# EAGLE design untitled (EAGLE 9.1.3)
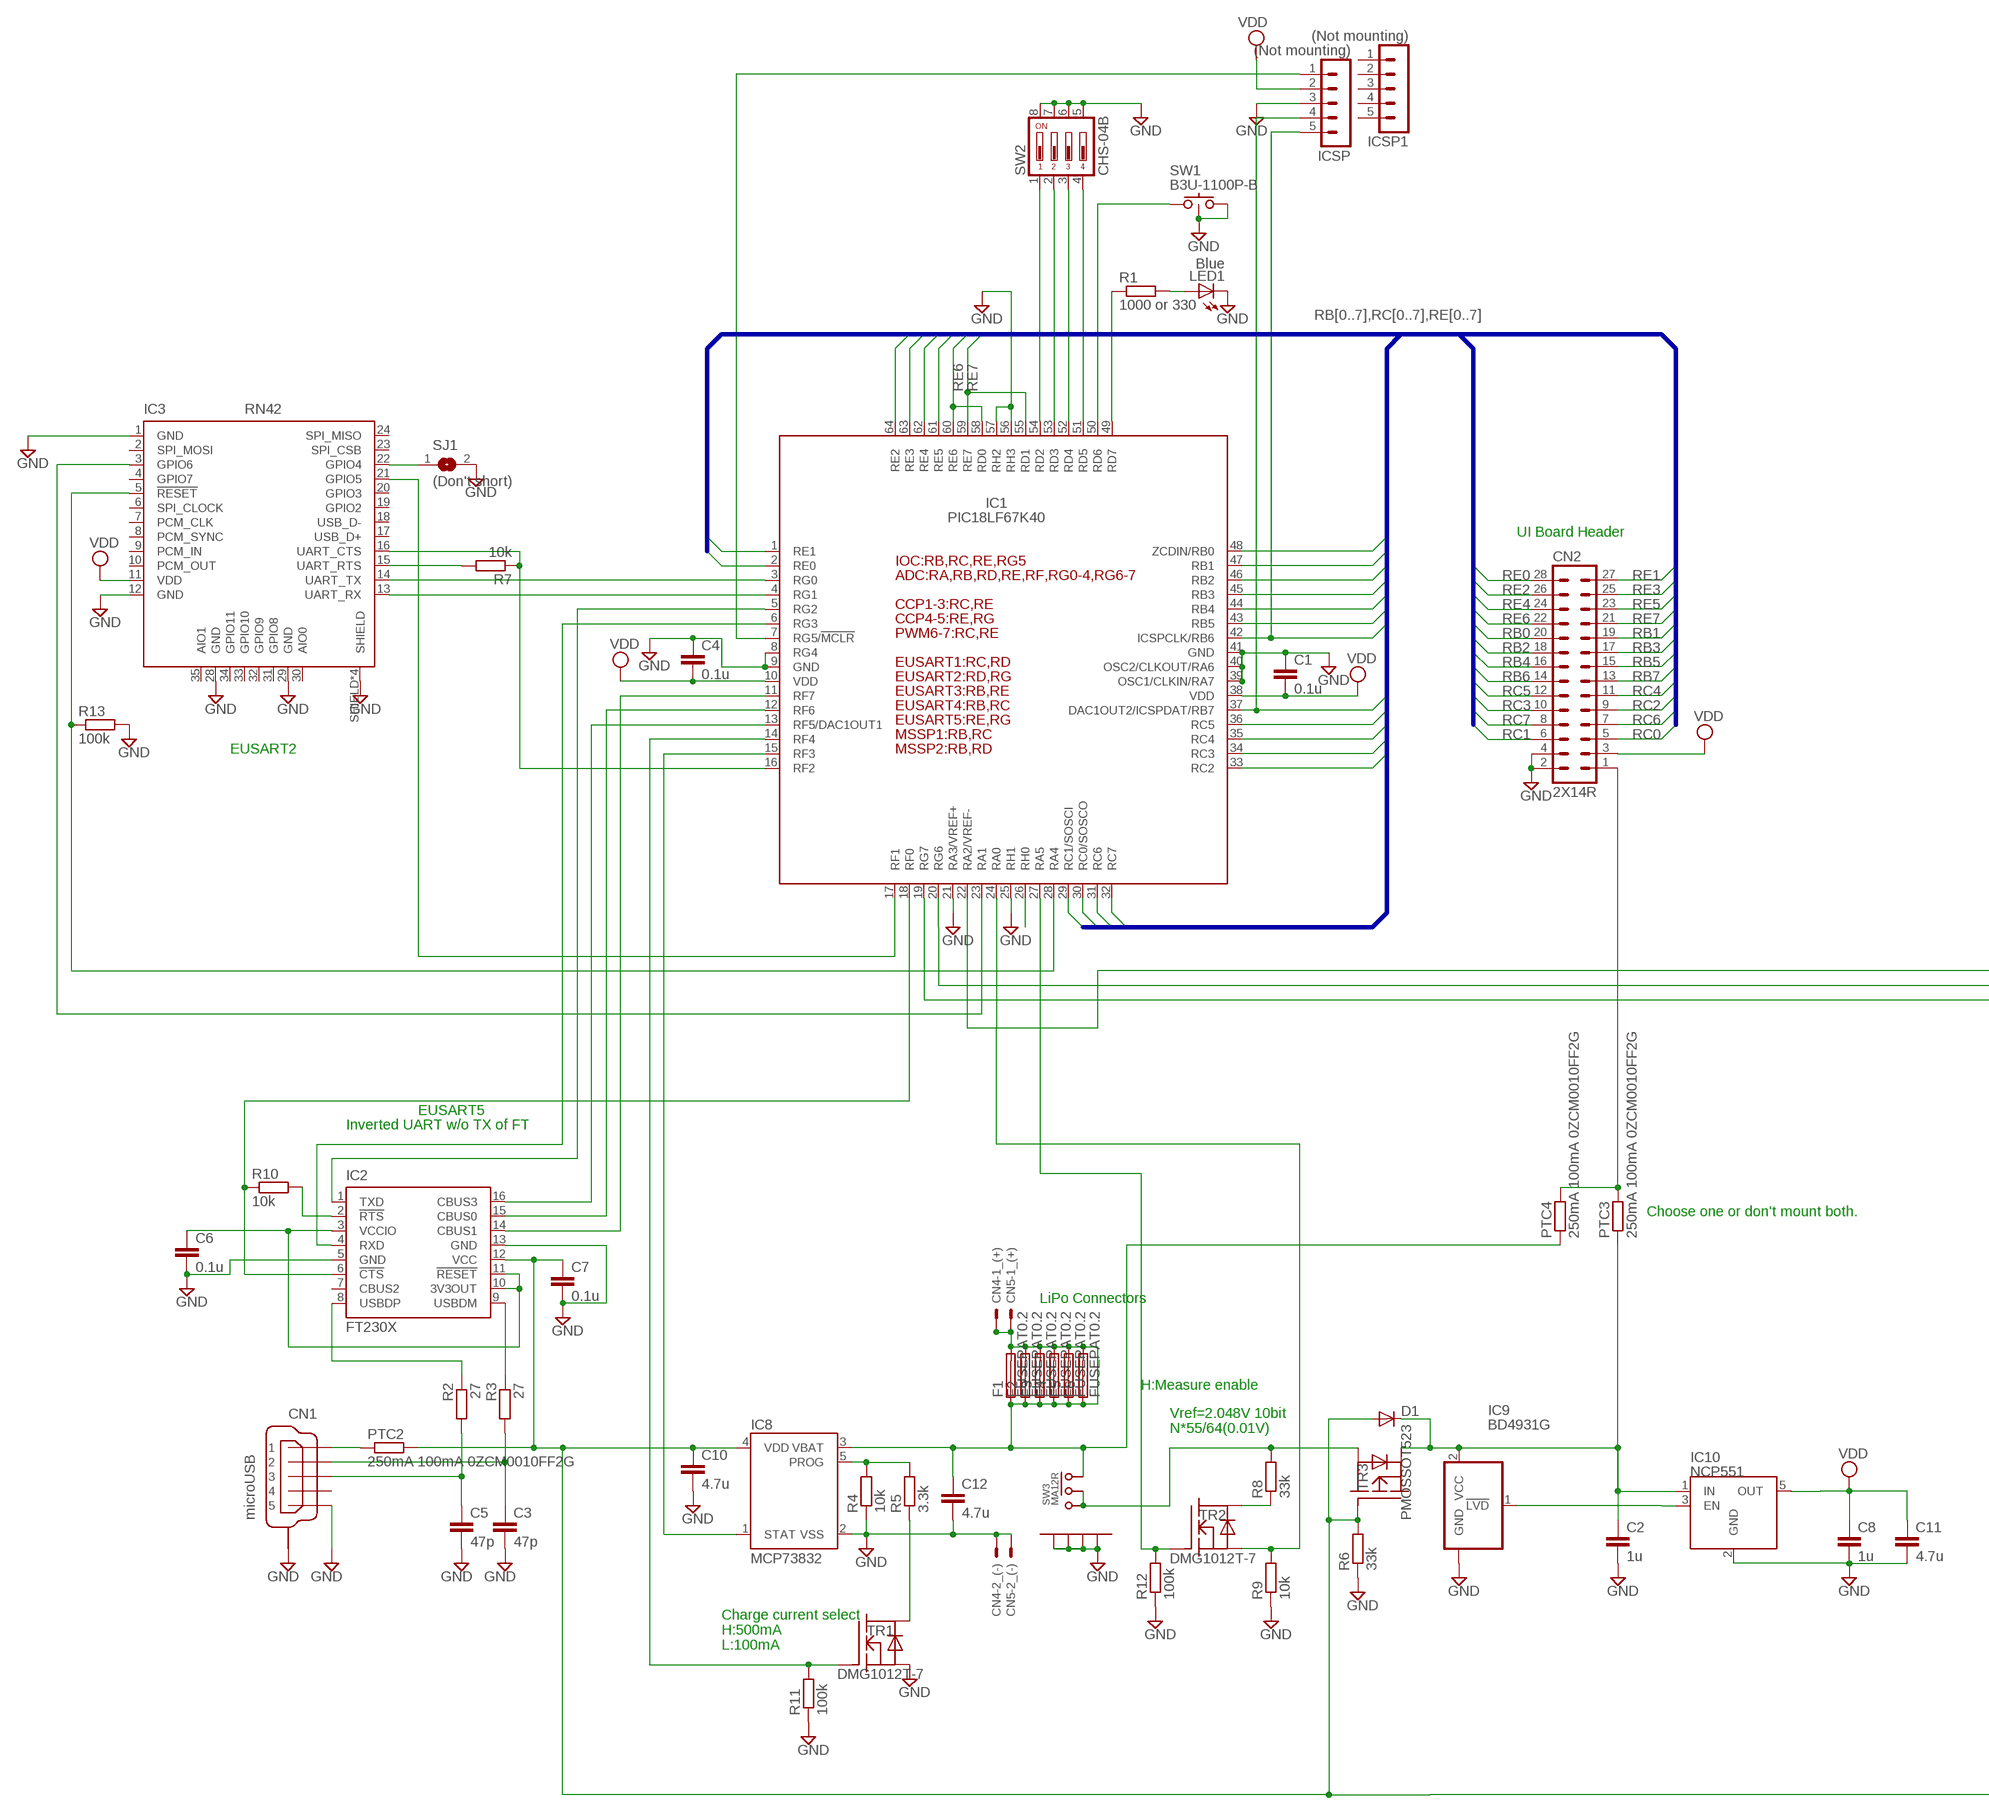
[diagram p0: schematic, sheet 1, part 1 of 2]
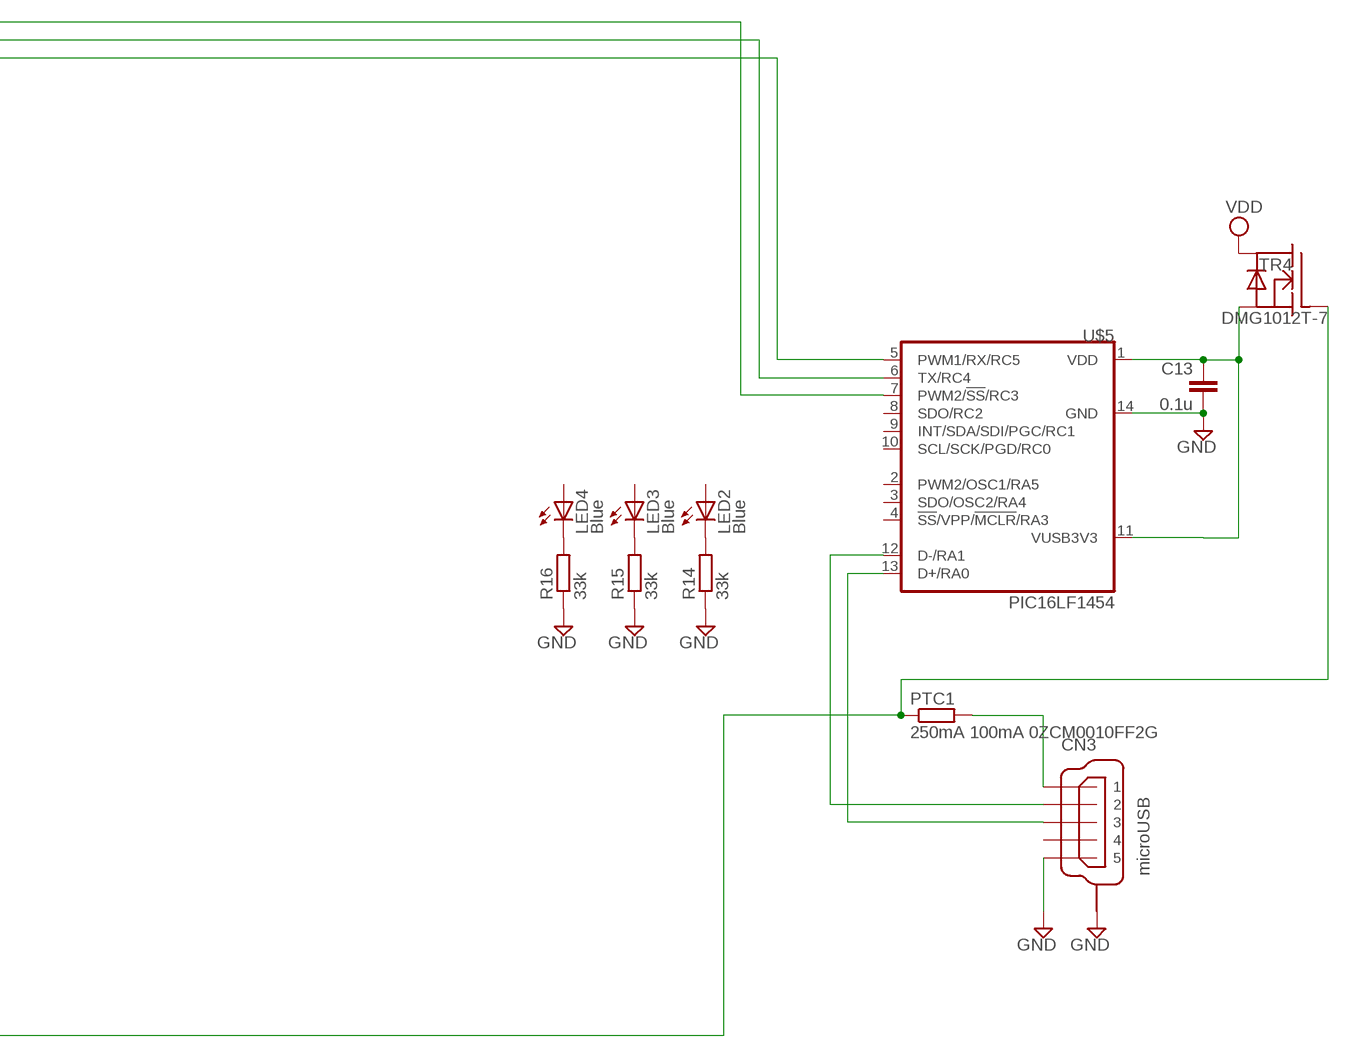
[diagram p1: schematic, sheet 1, part 2 of 2]

## Parts
C1  0.1u  C-EUC0402-SS  [C0402-SS]
C2  1u  C-EUC0805  [C0805]
C3  47p  C-EUC0402-SS  [C0402-SS]
C4  0.1u  C-EUC0402-SS  [C0402-SS]
C5  47p  C-EUC0402-SS  [C0402-SS]
C6  0.1u  C-EUC0402-SS  [C0402-SS]
C7  0.1u  C-EUC0402-SS  [C0402-SS]
C8  1u  C-EUC0805  [C0805]
C10  4.7u  C-EUC0805  [C0805]
C11  4.7u  C-EUC0805  [C0805]
C12  4.7u  C-EUC0805  [C0805]
C13  0.1u  C-EUC0402-SS  [C0402-SS]
CN1  microUSB  MICROUSB(10118194-0001LF)  [10118194-0001LF]
CN2  2X14R  [2MM_14X2_R]
CN3  microUSB  MICROUSB(10118194-0001LF)  [10118194-0001LF]
CN4  2P_(POWER)PH_S  [PH-2_S]
CN5  2P_(POWER)PH_S  [PH-2_S]
D1  DIODE-VMN2  [VMN2]
F1  FUSEPAT0.2  [FUSE_PAT1]
F2  FUSEPAT0.2  [FUSE_PAT1]
F3  FUSEPAT0.2  [FUSE_PAT1]
F4  FUSEPAT0.2  [FUSE_PAT1]
F5  FUSEPAT0.2  [FUSE_PAT1]
F6  FUSEPAT0.2  [FUSE_PAT1]
IC1  PIC18LF67K40  PIC18F67K40  [TQFP64-10X10]
IC2  FT230X  FT230XS  [SSOP16]
IC3  RN42  RN-42  [RN-42]
IC8  MCP73832  MCP73831  [SOT23-5L]
IC9  BD4931G  BD48XX  [SOT23-5L]
IC10  NCP551  [SOT23-5L]
ICSP  (Not mounting)  MA05-1  [MA05-1]
ICSP1  (Not mounting)  MA05-1  [MA05-1]
LED1  Blue  LED1005  [CHIP-LED1005]
LED2  Blue  LEDCHIPLED_1606(SIDE)  [CHIP-LED1606(SIDE)]
LED3  Blue  LEDCHIPLED_1606(SIDE)  [CHIP-LED1606(SIDE)]
LED4  Blue  LEDCHIPLED_1606(SIDE)  [CHIP-LED1606(SIDE)]
PTC1  250mA 100mA 0ZCM0010FF2G  R-EU_R0603  [R0603]
PTC2  250mA 100mA 0ZCM0010FF2G  R-EU_R0603  [R0603]
PTC3  250mA 100mA 0ZCM0010FF2G  R-EU_R0603  [R0603]
PTC4  250mA 100mA 0ZCM0010FF2G  R-EU_R0603  [R0603]
R1  1000 or 330  R-EU_R0402-SS  [R0402-SS]
R2  27  R-EU_R0402-SS  [R0402-SS]
R3  27  R-EU_R0402-SS  [R0402-SS]
R4  10k  R-EU_R0402-SS  [R0402-SS]
R5  3.3k  R-EU_R0402-SS  [R0402-SS]
R6  33k  R-EU_R0402-SS  [R0402-SS]
R7  10k  R-EU_R0402-SS  [R0402-SS]
R8  33k  R-EU_R0402-SS  [R0402-SS]
R9  10k  R-EU_R0402-SS  [R0402-SS]
R10  10k  R-EU_R0402-SS  [R0402-SS]
R11  100k  R-EU_R0402-SS  [R0402-SS]
R12  100k  R-EU_R0402-SS  [R0402-SS]
R13  100k  R-EU_R0402-SS  [R0402-SS]
R14  33k  R-EU_R0402-SS  [R0402-SS]
R15  33k  R-EU_R0402-SS  [R0402-SS]
R16  33k  R-EU_R0402-SS  [R0402-SS]
SJ1  (Don't short)  SJ  [SJ]
SW1  B3U-1100P-B  SW_WITH_EARTH(B3U-1100P)  [B3U-1100P-B]
SW2  CHS-04B  [CHS-04B]
SW3  MA12R  [MA12R]
TR1  DMG1012T-7  NMOSSOT523  [SOT523]
TR2  DMG1012T-7  NMOSSOT523  [SOT523]
TR3  PMOSSOT523  [SOT523]
TR4  DMG1012T-7  NMOSSOT523  [SOT523]
U$5  PIC16LF1454  PIC16F1454  [TSSOP14]

## Nets
GND: C1.1 C2.2 C3.2 C4.1 C5.2 C6.2 C7.2 C8.2 C10.2 C11.2 C12.2 C13.2 CN1.P$5 CN1.P$6(S) CN1.P$7(S) CN1.S1(S) CN1.S2(S) CN1.S3(S) CN1.S4(S) CN1.S5(S) CN1.S6(S) CN1.S7(S) CN1.S8(S) CN1.S9(S) CN1.S10(S) CN2.2 CN2.4 CN3.P$5 CN3.P$6(S) CN3.P$7(S) CN3.S1(S) CN3.S2(S) CN3.S3(S) CN3.S4(S) CN3.S5(S) CN3.S6(S) CN3.S7(S) CN3.S8(S) CN3.S9(S) CN3.S10(S) CN4.2 CN5.2 IC1.8(RG4) IC1.9(GND) IC1.21(RA3/VREF+) IC1.25(RH1) IC1.39(OSC1/CLKIN/RA7) IC1.40(OSC2/CLKOUT/RA6) IC1.41(GND) IC1.56(RH3) IC1.57(RH2) IC2.5(GND) IC2.13(GND) IC3.1(GND) IC3.12(GND) IC3.28(GND) IC3.29(GND) IC3.SHIELD IC3.SHIELD@1(SHIELD) IC3.SHIELD@2(SHIELD) IC3.SHIELD@3(SHIELD) IC8.2(VSS) IC9.3(GND) IC10.2(GND) ICSP.3 LED1.C R4.1 R6.1 R9.1 R11.1 R12.1 R13.2 R14.1 R15.1 R16.1 SJ1.2 SW1.P$2 SW1.P$3 SW2.5 SW2.6 SW2.7 SW2.8 SW3.P$4 SW3.P$5 SW3.P$6 SW3.P$7 TR1.2(S) U$5.14(GND)
N$1: IC1.4(RG1) IC3.13(UART_RX)
N$2: IC1.5(RG2) IC2.1(TXD)
N$3: IC1.3(RG0) IC3.14(UART_TX)
N$4: IC1.26(RH0)
N$5: C5.1 CN1.P$3 R2.2
N$6: C3.1 CN1.P$2 R3.2
N$7: IC1.6(RG3) IC2.4(RXD)
N$8 [Vbat]: CN2.1 PTC3.2 PTC4.2
N$10: IC1.15(RF3) IC8.1(STAT)
N$11: CN3.P$3 U$5.13(D+/RA0)
N$12 [Vbat]: C12.1 CN4.1 CN5.1 F1.P$1 F1.P$2 F2.P$1 F2.P$2 F3.P$1 F3.P$2 F4.P$1 F4.P$2 F5.P$1 F5.P$2 F6.P$1 F6.P$2 IC8.3(VBAT) PTC4.1 SW3.P$1
N$13 [Vbat]: R8.2 SW3.P$2 SW3.P$3 TR3.3(D)
N$14: IC1.7(RG5/!MCLR) ICSP.1
N$15 [Vbat]: CN3.P$1 PTC1.2
N$16: CN3.P$2 U$5.12(D-/RA1)
N$17: C13.1 TR4.2(S) U$5.1(VDD) U$5.11(VUSB3V3)
N$18: LED2.C R14.2
N$19 [Vbat]: C7.1 C10.1 D1.A IC2.12(VCC) IC8.4(VDD) PTC1.1 PTC2.2 R6.2 TR3.1(G) TR4.1(G)
N$20 [Vbat]: CN1.P$1 PTC2.1
N$21: LED3.C R15.2
N$22: LED4.C R16.2
N$34: IC1.54(RD2) SW2.1
N$35: IC1.52(RD4) SW2.3
N$38: IC1.51(RD5) SW2.4
N$39: IC1.49(RD7) R1.1
N$40: IC1.28(RA4) IC3.5(!RESET) R13.1
N$41: LED1.A R1.2
N$42: C6.1 IC2.3(VCCIO) IC2.10(3V3OUT) IC2.11(!RESET)
N$43: IC1.50(RD6) SW1.P$1
N$44: IC2.9(USBDM) R3.1
N$45: IC1.53(RD3) SW2.2
N$46: IC2.8(USBDP) R2.1
N$48: IC1.12(RF6) IC2.15(CBUS0)
N$49: IC1.13(RF5/DAC1OUT1) IC2.16(CBUS3)
N$50: IC8.5(PROG) R4.2 R5.2
N$51: IC1.27(RA5) R12.2 TR2.1(G)
N$52: IC1.16(RF2) IC3.16(UART_CTS) R7.1
N$53: IC1.14(RF4) R11.2 TR1.1(G)
N$54: IC3.15(UART_RTS) R7.2
N$55: IC1.11(RF7) IC2.14(CBUS1)
N$56: IC2.2(!RTS) R10.2
N$57: IC1.18(RF0) IC2.6(!CTS) R10.1
N$58: IC1.17(RF1) IC3.21(GPIO5)
N$59: IC3.22(GPIO4) SJ1.1
N$70: IC9.1(!LVD!) IC10.3(EN)
N$71: R5.1 TR1.3(D)
N$72: IC1.20(RG6) U$5.6(TX/RC4)
N$73: R8.1 TR2.3(D)
N$74: IC1.24(RA0) R9.2 TR2.2(S)
N$75: IC1.22(RA2/VREF-) U$5.7(PWM2/!SS!/RC3)
N$95: IC1.19(RG7) U$5.5(PWM1/RX/RC5)
N$96: IC1.23(RA1) IC3.3(GPIO6)
RB0: CN2.20 IC1.48(ZCDIN/RB0)
RB1: CN2.19 IC1.47(RB1)
RB2: CN2.18 IC1.46(RB2)
RB3: CN2.17 IC1.45(RB3)
RB4: CN2.16 IC1.44(RB4)
RB5: CN2.15 IC1.43(RB5)
RB6: CN2.14 IC1.42(ICSPCLK/RB6) ICSP.5
RB7: CN2.13 IC1.37(DAC1OUT2/ICSPDAT/RB7) ICSP.4
RC0: CN2.5 IC1.30(RC0/SOSCO)
RC1: CN2.6 IC1.29(RC1/SOSCI)
RC2: CN2.9 IC1.33(RC2)
RC3: CN2.10 IC1.34(RC3)
RC4: CN2.11 IC1.35(RC4)
RC5: CN2.12 IC1.36(RC5)
RC6: CN2.7 IC1.31(RC6)
RC7: CN2.8 IC1.32(RC7)
RE0: CN2.28 IC1.2(RE0)
RE1: CN2.27 IC1.1(RE1)
RE2: CN2.26 IC1.64(RE2)
RE3: CN2.25 IC1.63(RE3)
RE4: CN2.24 IC1.62(RE4)
RE5: CN2.23 IC1.61(RE5)
RE6: CN2.22 IC1.58(RD0) IC1.60(RE6)
RE7: CN2.21 IC1.55(RD1) IC1.59(RE7)
VBAT [Vbat]: C2.1 D1.C IC9.2(VCC) IC10.1(IN) PTC3.1 TR3.2(S)
VDD: C1.2 C4.2 C8.1 C11.1 CN2.3 IC1.10(VDD) IC1.38(VDD) IC3.11(VDD) IC10.5(OUT) ICSP.2 TR4.3(D)
Unconnected: CN1.P$4 CN3.P$4 IC2.7(CBUS2) IC3.2(SPI_MOSI) IC3.4(GPIO7) IC3.6(SPI_CLOCK) IC3.7(PCM_CLK) IC3.8(PCM_SYNC) IC3.9(PCM_IN) IC3.10(PCM_OUT) IC3.17(USB_D+) IC3.18(USB_D-) IC3.19(GPIO2) IC3.20(GPIO3) IC3.23(SPI_CSB) IC3.24(SPI_MISO) IC3.30(AIO0) IC3.31(GPIO8) IC3.32(GPIO9) IC3.33(GPIO10) IC3.34(GPIO11) IC3.35(AIO1) ICSP1.1 ICSP1.2 ICSP1.3 ICSP1.4 ICSP1.5 LED2.A LED3.A LED4.A U$5.2(PWM2/OSC1/RA5) U$5.3(SDO/OSC2/RA4) U$5.4(!SS!/VPP/!MCLR!/RA3) U$5.8(SDO/RC2) U$5.9(INT/SDA/SDI/PGC/RC1) U$5.10(SCL/SCK/PGD/RC0)

## Buses
RB[0..7],RC[0..7],RE[0..7]

## Notes on the sheet
- UI Board Header
- EUSART2
- EUSART5
- Inverted UART w/o TX of FT
- Choose one or don't mount both.
- LiPo Connectors
- H:Measure enable
- Vref=2.048V 10bit
  N*55/64(0.01V)
- Charge current select
  H:500mA
  L:100mA

## Library data of the parts
C1-C8 C10-C13 = 2 RCL:C-EU: CAPACITOR, European symbol
CN1 CN3 = 0 my parts:MICROUSB
CN2 = 4 _ll_ll_:2X14
CN4 CN5 = 4 CONNECTOR:2P_(POWER)
D1 = 5 D:DIODE-: DIODE
F1-F6 = 3 FUSE:FUSE: Fuse
IC1 = 0 my parts:PIC18F6*
IC2 = ftdichip:FT230X: USB to BASIC UART IC Auto generated by make-symbol-device-package-bsdl.ulp Rev. 43 Source: Data sheet <http://www.ftdichip.com/Support/Documents/DataSheets/ICs/DS_FT230X.pdf>
IC3 = 0 my parts:RN-42
IC8 = 0 my parts:MCP73831
IC9 = 0 my parts:BD48XX
IC10 = 0 my parts:NCP551
ICSP ICSP1 = 4 _l__l_:MA05-1: PIN HEADER
LED1-LED4 = 0 my parts:LED: LED OSRAM: - CHIPLED LG R971, LG N971, LY N971, LG Q971, LY Q971, LO R971, LY R971 LH N974, LH R974 LS Q976, LO Q976, LY Q976 LO Q996 - Hyper CHIPLED LW Q18S LB Q993, LB Q99A, LB R99A - SideLED LS A670, LO A670, LY A670, LG A670, LP A670 LB A673, LV A673, LT A673, LW A673 LH A674 LY A675 LS A676, LA A676, LO A676, LY A676, LW A676 LS A679, LY A679, LG A679 - Hyper Micro SIDELED® LS Y876, LA Y876, LO Y876, LY Y876 LT Y87S - SmartLED LW L88C, LW L88S LB L89C, LB L89S, LG L890 LS L89K, LO L89K, LY L89K LS L896, LA L896, LO L896, LY L896 - TOPLED LS T670, LO T670, LY T670, LG T670, LP T670 LSG T670, LSP T670, LSY T670, LOP T670, LYG T670 LG T671, LOG T671, LSG T671 LB T673, LV T673, LT T673, LW T673 LH T674 LS T676, LA T676, LO T676, LY T676, LB T676, LH T676, LSB T676, LW T676 LB T67C, LV T67C, LT T67C, LS T67K, LO T67K, LY T67K, LW E67C LS E67B, LA E67B, LO E67B, LY E67B, LB E67C, LV E67C, LT E67C LW T67C LS T679, LY T679, LG T679 LS T770, LO T770, LY T770, LG T770, LP T770 LB T773, LV T773, LT T773, LW T773 LH T774 LS E675, LA E675, LY E675, LS T675 LS T776, LA T776, LO T776, LY T776, LB T776 LHGB T686 LT T68C, LB T68C - Hyper Mini TOPLED® LB M676 - Mini TOPLED Santana® LG M470 LS M47K, LO M47K, LY M47K Source: http://www.osram.convergy.de - LUMILED® LXK2-PW12-R00, LXK2-PW12-S00, LXK2-PW14-U00, LXK2-PW14-V00 LXK2-PM12-R00, LXK2-PM12-S00, LXK2-PM14-U00 LXK2-PE12-Q00, LXK2-PE12-R00, LXK2-PE12-S00, LXK2-PE14-T00, LXK2-PE14-U00 LXK2-PB12-K00, LXK2-PB12-L00, LXK2-PB12-M00, LXK2-PB14-N00, LXK2-PB14-P00, LXK2-PB14-Q00 LXK2-PR12-L00, LXK2-PR12-M00, LXK2-PR14-Q00, LXK2-PR14-R00 LXK2-PD12-Q00, LXK2-PD12-R00, LXK2-PD12-S00 LXK2-PH12-R00, LXK2-PH12-S00 LXK2-PL12-P00, LXK2-PL12-Q00, LXK2-PL12-R00 Source: www.luxeon.com
PTC1-PTC4 R1-R16 = 2 RCL:R-EU_: RESISTOR, European symbol
SJ1 = 3 JUMPER:SJ: SMD solder JUMPER
SW1 = 0 my parts:SW_WITH_EARTH
SW2 = 3 switch-copal:CHS-04: Copal Electronics, Distributor Bürklin
SW3 = 0 my parts:MA12R
TR1 TR2 TR4 = 0 my parts:NMOS
TR3 = 0 my parts:PMOS
U$5 = 0 my parts:PIC16F1454

## Net classes
1 Vbat: clearance 0.3 mm

## Board
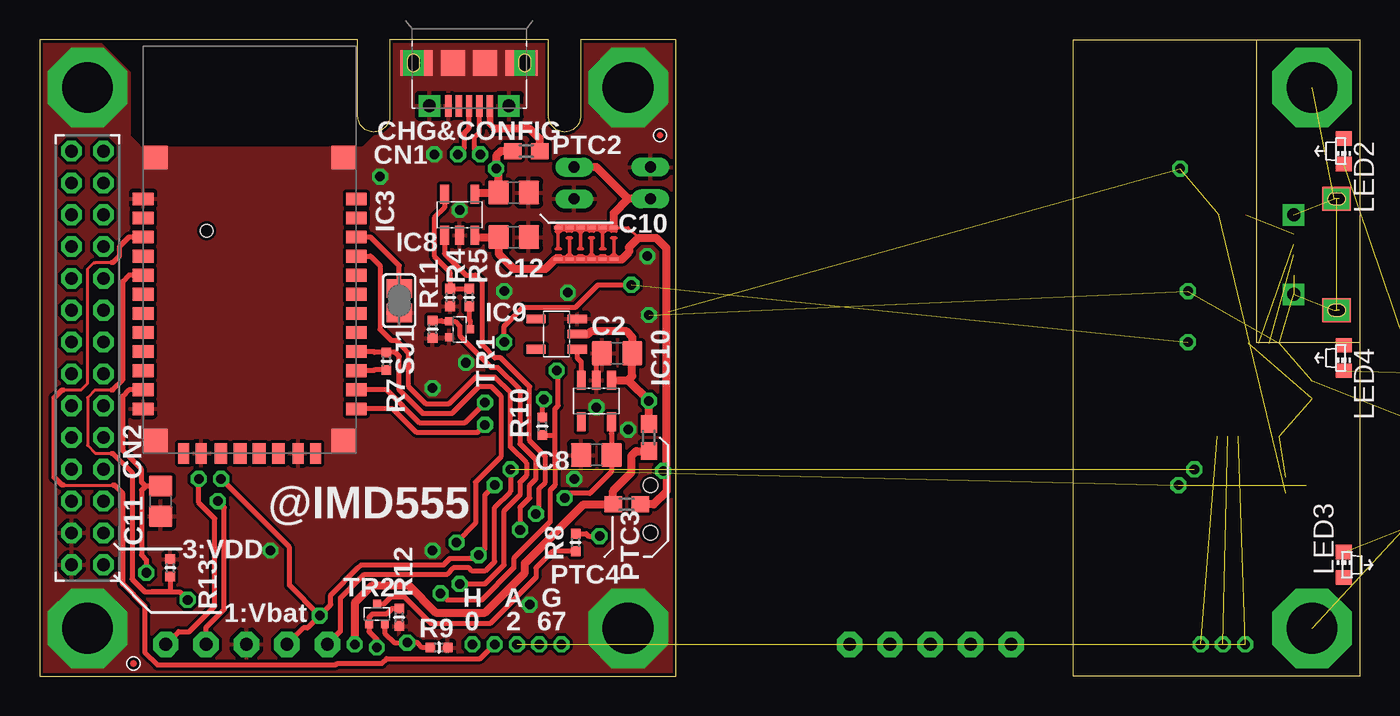
[diagram p2: board, top side]
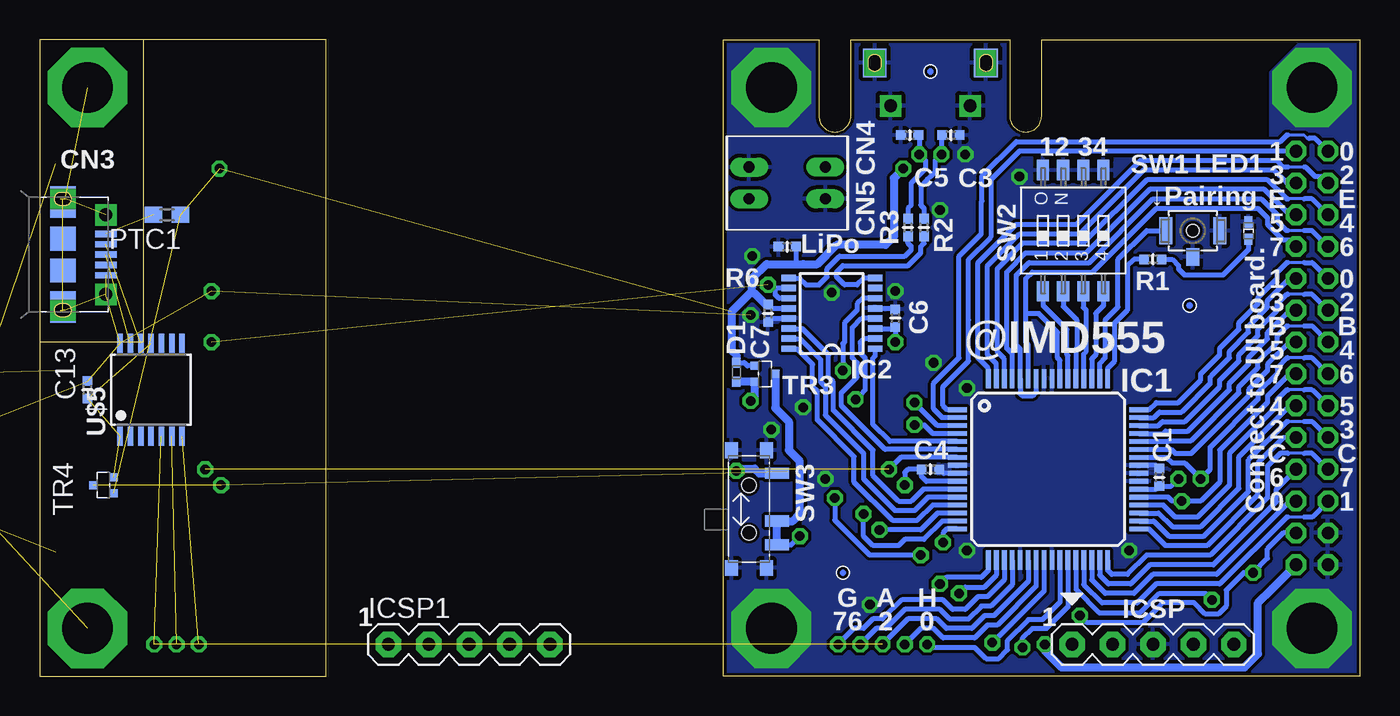
[diagram p3: board, bottom side, seen from below]

Size 83 x 40 mm. Coordinates in mm from the lower left corner, seen from the top.
Outline: 76.5,40 65,40 65,0 83,0 83,21
Outline: 76.5,40 83,40 83,21
Outline: 76.5,40 76.5,21 83,21
Outline: 0,0 40,0 40,40 34,40 34,35.2 arc-90 33,34.2 arc-90 32,35.2 32,40 22,40 22,35.2 arc-90 21,34.2 arc-90 20,35.2 20,40 0,40 0,0
Copper layers (1*16): Top 0.035mm / dielectric 1.5mm / Bottom 0.035mm
Design rules "SeeedStudio_2layer_DRU_no_angle_20140221_IMD555": minimum track width 0.2mm, minimum drill 0.3mm, track to track 0.2mm, track to pad 0.2mm, pad to pad 0.2mm, via to via 0.2mm, smd to smd 0mil, copper to edge 0.2mm, drill to drill 10mil, minimum pad ring 0.25mm, minimum via ring 0.2mm, stop-mask expansion 0.03mm, vias tented up to drill 5mm, thermal gap 10mil
tRestrict: area 3.8,33.4 to 21.8,40; 2 lines
bRestrict: area 3.8,33.4 to 21.8,40; 4 lines

### Footprints (pad centres in the part's own frame; a part is rotated, then mirrored left to right if it is on the bottom)
C0402-SS = smd 0.6 x 0.6: 1 -0.55,0; 2 0.55,0
C0805 = smd 1.3 x 1.5: 1 -0.95,0; 2 0.95,0
10118194-0001LF = smd 0.4 x 1.35: P$1 -1.3,4.15; P$2 -0.65,4.15; P$3 0,4.15; P$4 0.65,4.15; P$5 1.3,4.15 | smd 1.5 x 1.8 bottom: P$6 -3.5,1.45; P$7 3.5,1.45 | drill 0.8 pad 1.35 square: S1 -2.5,4.15; S2 2.5,4.15 | drill 0.8 pad 1.3 square: S3 -3.5,1.6; S4 -3.5,1.3; S9 3.5,1.6; S10 3.5,1.3 | smd 2 x 1.6: S5 -3.3,1.45; S8 3.3,1.45 | smd 1.5 x 1.6: S6 -1,1.45; S7 1,1.45
2MM_14X2_R = drill 0.8 pad 1.3 octagon: 1 13,1; 2 13,-1; 3 11,1; 4 11,-1; 5 9,1; 6 9,-1; 7 7,1; 8 7,-1; 9 5,1; 10 5,-1; 11 3,1; 12 3,-1; 13 1,1; 14 1,-1; 15 -1,1; 16 -1,-1; 17 -3,1; 18 -3,-1; 19 -5,1; 20 -5,-1; 21 -7,1; 22 -7,-1; 23 -9,1; 24 -9,-1; 25 -11,1; 26 -11,-1; 27 -13,1; 28 -13,-1
PH-2_S = drill 0.7 long: 1 1,0; 2 -1,0
VMN2 = smd 0.65 x 0.55: A 0.6,0; C -0.6,0
FUSE_PAT1 = smd 0.2 x 0.5: P$1 -1,0; P$2 1,0
TQFP64-10X10 = smd 1.2 x 0.3: 1 -5.7,3.75; 2 -5.7,3.25; 3 -5.7,2.75; 4 -5.7,2.25; 5 -5.7,1.75; 6 -5.7,1.25; 7 -5.7,0.75; 8 -5.7,0.25; 9 -5.7,-0.25; 10 -5.7,-0.75; 11 -5.7,-1.25; 12 -5.7,-1.75; 13 -5.7,-2.25; 14 -5.7,-2.75; 15 -5.7,-3.25; 16 -5.7,-3.75; 33 5.7,-3.75; 34 5.7,-3.25; 35 5.7,-2.75; 36 5.7,-2.25; 37 5.7,-1.75; 38 5.7,-1.25; 39 5.7,-0.75; 40 5.7,-0.25; 41 5.7,0.25; 42 5.7,0.75; 43 5.7,1.25; 44 5.7,1.75; 45 5.7,2.25; 46 5.7,2.75; 47 5.7,3.25; 48 5.7,3.75 | smd 0.3 x 1.2: 17 -3.75,-5.7; 18 -3.25,-5.7; 19 -2.75,-5.7; 20 -2.25,-5.7; 21 -1.75,-5.7; 22 -1.25,-5.7; 23 -0.75,-5.7; 24 -0.25,-5.7; 25 0.25,-5.7; 26 0.75,-5.7; 27 1.25,-5.7; 28 1.75,-5.7; 29 2.25,-5.7; 30 2.75,-5.7; 31 3.25,-5.7; 32 3.75,-5.7; 49 3.75,5.7; 50 3.25,5.7; 51 2.75,5.7; 52 2.25,5.7; 53 1.75,5.7; 54 1.25,5.7; 55 0.75,5.7; 56 0.25,5.7; 57 -0.25,5.7; 58 -0.75,5.7; 59 -1.25,5.7; 60 -1.75,5.7; 61 -2.25,5.7; 62 -2.75,5.7; 63 -3.25,5.7; 64 -3.75,5.7
SSOP16 = smd 0.914 x 0.406: 1 -2.718,2.223; 2 -2.718,1.587; 3 -2.718,0.953; 4 -2.718,0.318; 5 -2.718,-0.318; 6 -2.718,-0.953; 7 -2.718,-1.587; 8 -2.718,-2.223; 9 2.718,-2.223; 10 2.718,-1.587; 11 2.718,-0.953; 12 2.718,-0.318; 13 2.718,0.318; 14 2.718,0.953; 15 2.718,1.587; 16 2.718,2.223
RN-42 = smd 1.3 x 0.8: 1 -6.7,16; 2 -6.7,14.8; 3 -6.7,13.6; 4 -6.7,12.4; 5 -6.7,11.2; 6 -6.7,10; 7 -6.7,8.8; 8 -6.7,7.6; 9 -6.7,6.4; 10 -6.7,5.2; 11 -6.7,4; 12 -6.7,2.8; 13 6.7,2.8; 14 6.7,4; 15 6.7,5.2; 16 6.7,6.4; 17 6.7,7.6; 18 6.7,8.8; 19 6.7,10; 20 6.7,11.2; 21 6.7,12.4; 22 6.7,13.6; 23 6.7,14.8; 24 6.7,16 | smd 0.7 x 1.3: 28 3.05,0; 29 -3.05,0; 30 4.15,0; 35 -4.15,0 | smd 0.8 x 1.3: 31 1.8,0; 32 0.6,0; 33 -0.6,0; 34 -1.8,0 | smd 1.5 x 1.5: SHIELD -5.9,18.6; SHIELD@1 -5.9,0.8; SHIELD@2 5.9,0.8; SHIELD@3 5.9,18.6
SOT23-5L = smd 0.55 x 1.2: 1 -0.95,-1.3; 2 0,-1.3; 3 0.95,-1.3; 4 0.95,1.3; 5 -0.95,1.3
MA05-1 = drill 0.8 pad 1.6 octagon: 1 -5.08,0; 2 -2.54,0; 3 0,0; 4 2.54,0; 5 5.08,0
CHIP-LED1005 = smd 0.5 x 0.7: A 0,-0.55; C 0,0.55
CHIP-LED1606(SIDE) = smd 1 x 0.9: A 0,-0.8; C 0,0.8
R0603 = smd 1.1 x 1: 1 -0.85,0; 2 0.85,0
R0402-SS = smd 0.6 x 0.6: 1 -0.55,0; 2 0.55,0
SJ = smd 1.168 x 1.6: 1 -0.762,0; 2 0.762,0
B3U-1100P-B = smd 0.8 x 1.7: P$1 -1.7,0; P$2 1.7,0 | smd 0.8 x 1.1: P$3 0,-1.65 | hole 0.8: 0,0
CHS-04B = smd 0.76 x 1.27: 1 0,-3.81; 2 1.27,-3.81; 3 2.54,-3.81; 4 3.81,-3.81; 5 3.81,3.81; 6 2.54,3.81; 7 1.27,3.81; 8 0,3.81
MA12R = smd 0.7 x 1.5: P$1 -2.25,1.75; P$2 0.75,1.75; P$3 2.25,1.75 | smd 1 x 0.8: P$4 -3.7,1.1; P$5 -3.7,-1.1; P$6 3.7,-1.1; P$7 3.7,1.1 | hole 0.9: -1.5,0; 1.5,0
SOT523 = smd 0.5 x 0.5: 1 -0.5,-0.65; 2 0.5,-0.65; 3 0,0.65
TSSOP14 = smd 0.35 x 1.2: 1 -1.95,-2.925; 2 -1.3,-2.925; 3 -0.65,-2.925; 4 0,-2.925; 5 0.65,-2.925; 6 1.3,-2.925; 7 1.95,-2.925; 8 1.95,2.925; 9 1.3,2.925; 10 0.65,2.925; 11 0,2.925; 12 -0.65,2.925; 13 -1.3,2.925; 14 -1.95,2.925

### Placement (x,y rotation side)
C1  12.6,12.5 270 bottom
C2  36.3,20.3 180 top
C3  28.3,34 180 bottom
C4  27,13 180 bottom
C5  25.7,34 0 bottom
C6  29.2,22.5 90 bottom
C7  37.2,22.8 270 bottom
C8  35,13.9 180 top
C10  29.8,30.4 0 top
C11  7.6,11 270 top
C12  29.8,27.6 0 top
C13  80,18 90 bottom
CN1  27,40 180 top
CN2  3,20 270 top
CN3  83,26.5 270 bottom
CN4  33.6,31 90 bottom
CN5  38.4,31 270 bottom
D1  39.2,19.1 90 bottom
F1  35.4,27.2 90 top
F2  34.7,27.2 270 top
F3  34,27.2 90 top
F4  33.3,27.2 270 top
F5  32.6,27.2 90 top
F6  36.1,27.2 270 top
IC1  19.6,13 0 bottom
IC2  33.2,22.8 180 bottom
IC3  13.2,14 0 top
IC8  26.4,29 0 top
IC9  32.5,21.5 90 top
IC10  35,17.3 180 top
ICSP  13,2 0 bottom
ICSP1  56,2 0 bottom
LED1  7,28 0 bottom
LED2  82,33 180 top
LED3  82,7 0 top
LED4  82,20 180 top
PTC1  75,29 180 bottom
PTC2  30.6,33 180 top
PTC3  38.3,15 270 top
PTC4  36.9,10.8 180 top
R1  13,26.2 0 bottom
R2  27.4,28.2 90 bottom
R3  28.4,28.2 90 bottom
R4  25.8,23.8 90 top
R5  27,23.8 90 top
R6  36,27 0 bottom
R7  21.8,19.8 270 top
R8  33.7,8.4 90 top
R9  25.1,1.8 180 top
R10  31.6,15.7 90 top
R11  24.7,21.8 90 top
R12  22.6,3.7 90 top
R13  8.2,6.8 90 top
R14  87,16 0 top  (outside the outline)
R15  87,10 0 top  (outside the outline)
R16  88,19 0 top  (outside the outline)
SJ1  22.6,23.6 270 top
SW1  10.5,28 0 bottom
SW2  19.92,28 0 bottom
SW3  38.4,10.5 270 bottom
TR1  26.4,21.8 270 top
TR2  21.2,3.9 0 top
TR3  37.4,19 270 bottom
TR4  79,12 90 bottom
U$1  [PCB_CHECK]  5.9,0.8 0 top
U$2  [RULER]  65,43 0 top
U$3  [PCB_CHECK]  39,34 0 top
U$4  [RULER-S]  -10,0 90 bottom  (outside the outline)
U$5  76,18 0 bottom
U$6  [PCB_CHECK]  32.5,6.5 0 bottom
U$8  [PCB_CHECK]  10.7,23.3 0 bottom
U$9  [PCB_CHECK]  27,38 0 bottom

### Tracks (layer width: path | path; a pad name or v marks a point on that pad's centre or on a via)
GND  (via drill 0.6, 3.2 pad 5)  (21 unrouted)
  Top 0.3: IC10.2 35,19.95 C2.2
  Bottom 0.3: IC1.9 26.15,12.75 26.4,13 C4.1 | C1.1 12.8,13.25 IC1.41 | C7.2 36.97,22.48 IC2.13 | IC2.5 29.27,23.12 C6.2
  other vias: 21.4,31.4 24.7,18.1 14.5,7.9 24.7,7.9 29.2,24.2 30.8,4.5 38.2,26.4 24.8,32.8 37,37 3,37 3,3 37,3 37,15.5 26.8,19.7 33.2,24.1 26.4,29.3 38.3,22.7 35,16.9 33.6,12.4 80,37 80,3 72.2,24.2
  pour Bottom: 0,40 40,40 40,0 0,0
  pour Top: 0,40 40,40 40,0 0,0
N$1  (via drill 0.6)
  Top 0.3: IC3.13 22.2,16.8 23.7,15.3 27.5,15.3 v28,15.8
  Bottom 0.3: IC1.4 26.85,15.25 27.4,15.8 v28,15.8
N$2
  Bottom 0.3: IC1.5 29.55,14.75 30.6,15.8 30.6,20 30.48,20.12 IC2.1
N$3  (via drill 0.6)
  Top 0.3: IC3.14 21.8,18 23.9,15.9 26.7,15.9 v28,17.2
  Bottom 0.3: IC1.3 26.55,15.75 v28,17.2
N$4  (via drill 0.6)
  Bottom 0.3: IC1.26 18.85,4.65 19.95,3.55 20.85,3.55 22.15,2.25 22.15,1.65 22.7,1.1 23.5,1.1 24.2,1.8 27,1.8 v27.2,2
N$5  (via drill 0.6)
  Top 0.3: v26.3,32.8 26.68,33.17 26.68,34.12 27,34.45 CN1.P$3
  Bottom 0.3: C5.1 26.3,33.95 v26.3,32.8 26.7,32.4 26.7,31.7 27,31.4 27.2,31.2 27.6,30.8 27.6,29.6 27.4,29.4 R2.2
N$6  (via drill 0.6)
  Top 0.3: v27.7,32.8 27.32,33.17 27.32,33.88 27.65,34.2 CN1.P$2
  Bottom 0.3: C3.1 27.7,33.95 v27.7,32.8 27.3,32.4 27.3,31.9 28.2,31 28.2,29.6 28.4,29.4 R3.2
N$7
  Bottom 0.3: IC2.4 31.32,22.48 31.9,21.9 31.9,21.1 31.9,20 31.6,19.7 31.6,18.8 31.9,18.5 32.6,17.8 32.6,17 29.85,14.25 IC1.6
N$8  (via drill 0.6)
  Top 0.5: v19.8,2 19.8,4.6 20.9,5.7 23.2,5.7 24.9,4 28,4 30.5,6.5 30.5,7.1 34.2,10.8 PTC4.2 36.05,11.65 37.2,12.8 37.2,13.85 37.5,14.15 PTC3.2
  Bottom 0.5: v19.8,2 19.8,1.6 18.75,0.55 7.25,0.55 6.4,1.4 6.4,4.6 5.5,5.5 CN2.1
N$10  (via drill 0.6)
  Top 0.3: IC8.1 25.45,26.55 26.8,25.2 27.4,25.2 27.8,24.8 27.8,20.82 28.61,20.01 28.99,20.01 30.8,18.2 30.8,14.8 31.8,13.8 31.8,12.2 31.4,11.8 31.4,10.4 v31.2,10.2
  Bottom 0.3: IC1.15 26.25,9.75 27.4,8.6 28.6,8.6 29,8.2 30.6,8.2 31.2,8.8 v31.2,10.2
N$11  (1 unrouted)
N$12  (via drill 0.6 pad 1)
  Top 0.2: F6.P$1 37,28.2 37.65,27.55
  Top 0.5: IC8.3 27.45,27.6 C12.1 28.85,26.55 29.8,25.6 31.8,25.6 32.4,26.2 F5.P$1 F4.P$2 F3.P$1 F2.P$2 F1.P$1 F6.P$2 36.6,26.2 37.05,26.65 37.05,26.95 37.65,27.55 38.75,27.55 39.1,27.2 39.4,26.9 39.4,13.1 v39.2,12.9 39.4,12.7 39.4,11.6 38.6,10.8 PTC4.1 | CN5.1 37,30 | 37,30 35,32 CN4.1 | F5.P$2 F4.P$1 F3.P$2 F2.P$1 F1.P$2 F6.P$1 36.1,29.1 37,30
  Bottom 0.5: v39.2,12.9 39.05,13.05 38.05,13.05 37.75,12.75 SW3.P$1
N$13  (via drill 0.6 pad 1)
  Top 0.3: v35.2,8.8 34.5,8.8 34.35,8.95 R8.2
  Bottom 0.3: v35.2,8.8 35.75,8.25 SW3.P$3
  Bottom 0.5: SW3.P$3 SW3.P$2 35.65,9.75 35.2,10.2 35.2,13.5 35.9,14.2 35.9,16 36.75,16.85 TR3.3
N$14  (via drill 0.6)  (1 unrouted)
  Top 0.3: v29.6,13 29.6,11.6 28.6,10.6 28.6,7.2 28,6.6 27.2,6.6 27,6.8 26,6.8 25.6,6.4 24,6.4 23.1,6.4 20.4,6.4 20.2,6.2 18.9,4.9 18.9,2.82 ICSP.1
  Bottom 0.3: v29.6,13 28.85,13.75 IC1.7
  other vias: 72.6,13
N$15  (1 unrouted)
N$16  (1 unrouted)
N$17  (3 unrouted)
N$18  (1 unrouted)
N$19  (via drill 0.6)  (3 unrouted)
  Top 0.5: IC8.4 27.45,30.4 C10.1 28.85,31.75 v28.7,31.9 28.7,32.4 28.7,32.7 29,33 PTC2.2
  Bottom 0.3: IC2.12 36.97,23.12 C7.1 | D1.A 38.7,19.7 38.5,19.5 TR3.1 | R6.2 35.45,25.9
  Bottom 0.5: 35,25.9 37.3,25.9 38.2,25 38.2,24.5 38.2,24.2 | 35,25.9 34.1,25.9 32.9,27.1 29.8,27.1 29.3,27.6 29.3,31.3 v28.7,31.9 | 38.2,24.2 38,24 37.35,23.35 C7.1 | 38.2,24.2 39.5,22.9 39.5,20.5 39.2,20.2 D1.A | 35.45,25.9 35,25.9
  other vias: 71.7,31.9
N$20
  Top 0.4: 28.6,34.4 28.3,34.7 CN1.P$1
  Top 0.5: 28.6,34.4 30.8,34.4 31.45,33.75 PTC2.1
N$21  (1 unrouted)
N$22  (1 unrouted)
N$34
  Bottom 0.3: SW2.1 19.92,23.32 18.4,21.8 18.4,20.2 18.35,20.15 IC1.54
N$35
  Bottom 0.3: IC1.52 17.35,20.25 17.2,20.4 17.2,23 17.38,23.18 SW2.3
N$38
  Bottom 0.3: IC1.51 16.85,19.95 16.6,20.2 16.6,22.8 16.11,23.29 SW2.4
N$39
  Bottom 0.3: IC1.49 15.85,19.35 15.4,19.8 15.4,22.2 14.6,23 14.6,25.8 14.25,26.15 14.2,26.2 R1.1
N$40  (via drill 0.6)
  Top 0.2: 4.5,18 3.5,18 3,17.5 3,14.5 3.5,14 4.5,14
  Top 0.3: IC3.5 5.6,25.2 5.2,24.8 5.2,18.6 4.6,18 4.5,18 | 7,5.3 6.6,5.3 5.8,6.1 5.8,12.8 4.6,14 4.5,14 | 7,5.3 8.8,5.3 v9.3,4.8 | R13.1 8.2,5.3 7,5.3
  Bottom 0.3: IC1.28 17.85,5.45 16.4,4 13.8,4 12.6,5.2 9.7,5.2 v9.3,4.8
N$41
  Bottom 0.3: LED1.A 7,26.8 8.6,25.2 11,25.2 11.4,25.6 11.4,25.8 11.8,26.2 R1.2
N$42  (via drill 0.6)  (1 unrouted)
  Top 0.3: v37.2,24.6 35.1,24.6 33.7,23.2 30.4,23.2 29.2,22 v29.2,21
  Bottom 0.3: v37.2,24.6 36.99,24.39 IC2.10 36.76,24.39 36.76,24 36.51,23.75 IC2.11 | v29.2,21 C6.1 29.3,21.85 IC2.3
  other vias: 72.2,21
N$43
  Bottom 0.3: IC1.50 16.35,19.65 16,20 16,22.4 15.2,23.2 15.2,26.2 13.4,28 SW1.P$1
N$44
  Bottom 0.3: IC2.9 35.22,25.02 34.8,24.6 34,24.6 33.5,25.1 33.5,25.6 32.7,26.4 28.6,26.4 28.2,26.8 28.2,27 28.4,27.2 R3.1
N$45
  Bottom 0.3: SW2.2 18.65,23.25 17.8,22.4 17.8,20.6 17.85,20.55 IC1.53
N$46
  Bottom 0.3: IC2.8 31.18,25.02 31.6,24.6 32.4,24.6 32.9,25.1 32.9,25.4 32.5,25.8 28.4,25.8 27.6,26.6 27.6,27 27.4,27.2 R2.1
N$48
  Bottom 0.3: IC1.12 27.15,11.25 28,10.4 29.2,10.4 31.2,12.4 31.2,14 33.6,16.4 33.6,18.2 33.9,18.5 33.9,19 33.9,19.9 35.21,21.21 IC2.15
N$49
  Bottom 0.3: IC1.13 26.85,10.75 27.8,9.8 29.4,9.8 31.8,12.2 31.8,13.8 34.1,16.1 34.1,17.9 34.4,18.2 34.4,19.6 35.38,20.58 IC2.16
N$50
  Top 0.3: R5.2 R4.2 25.8,25.4 24.8,26.4 24.8,28.8 25.45,29.45 IC8.5
N$51  (via drill 0.6)
  Top 0.3: v21.2,1.8 21.2,2.3 20.7,2.8 TR2.1 20.7,3.7 20.9,3.9 21.8,3.9 22.15,4.25 R12.2
  Bottom 0.3: IC1.27 18.35,4.35 19.7,3 20.6,3 21.2,2.4 v21.2,1.8
N$52  (via drill 0.6)
  Top 0.3: v26.2,8.4 27.4,9.6 27.4,12.2 29,13.8 29,17.6 28.4,18.2 27.6,18.2 25.9,16.5 24.1,16.5 22.6,18 22.6,20.1 22.35,20.35 R7.1 21.05,20.35 21,20.4 IC3.16
  Bottom 0.3: IC1.16 25.95,9.25 26.2,9 v26.2,8.4
N$53  (via drill 0.6)
  Top 0.3: v30.2,9.2 30.2,10.6 30.8,11.2 30.8,12 31.2,12.4 31.2,13.6 30.2,14.6 30.2,18 28.8,19.4 28.4,19.4 26.4,21.4 26.4,22 26.1,22.3 TR1.1 25.3,22.3 25.25,22.35 R11.2
  Bottom 0.3: IC1.14 26.55,10.25 27.6,9.2 v30.2,9.2
N$54
  Top 0.3: IC3.15 21,19.2 21.05,19.25 R7.2
N$55
  Bottom 0.3: IC1.11 27.45,11.75 28.2,11 29,11 30.6,12.6 30.6,14.2 33.1,16.7 33.1,18.5 33.4,18.8 33.4,20.2 35.05,21.85 IC2.14
N$56  (via drill 0.6)
  Top 0.3: v31.7,17.4 31.6,17.3 R10.2
  Bottom 0.3: IC2.2 31.19,21.21 31.4,21 31.4,20.9 31.4,20.3 31.1,20 31.1,18 31.4,17.7 v31.7,17.4
N$57  (via drill 0.6)
  Top 0.3: v25.2,5.2 25.6,4.8 27.8,4.8 29.8,6.8 29.8,7.4 32.1,9.7 32.1,11.7 32.4,12 32.4,13.3 | 32.4,16.8 32.4,15.15 R10.1 | 32.4,16.8 32.6,17 32.6,19.1 v32.5,19.2 | 32.4,14 32.4,13.3 | 32.4,13.3 32.4,16.8
  Bottom 0.3: IC2.6 31.25,23.75 31.6,23.4 31.6,23 32.4,22.2 32.4,21 32.5,20.9 v32.5,19.2 | v25.2,5.2 24.8,5.6 23.6,5.6 22.85,6.35 IC1.18
N$58  (via drill 0.6)
  Top 0.3: IC3.21 20.8,26.4 21.4,25.8 21.4,21.8 22.1,21.1 22.4,21.1 22.9,20.6 23.2,20.3 23.2,18.2 24.3,17.1 25.7,17.1 27.4,18.8 27.5,18.8 28.6,18.8 29.6,17.8 29.6,14.4 30.6,13.4 30.6,12.6 30.2,12.2 30.2,11.4 29.2,10.4 29.2,7 28,5.8 v26.4,5.8
  Bottom 0.3: IC1.17 23.35,6.65 23.8,6.2 26,6.2 v26.4,5.8
N$59
  Top 0.3: SJ1.1 22.6,25.8 20.8,27.6 IC3.22
N$70
  Top 0.3: IC9.1 33.8,20 34.05,19.75 IC10.3
N$71
  Top 0.3: R5.1 27,22.4 27.05,22.35 TR1.3
N$72  (via drill 0.6)  (2 unrouted)
  Bottom 0.3: IC1.20 21.85,5.75 23.2,4.4 23.8,4.4 24.6,3.6 25.8,3.6 26.4,4.2 28.6,4.2 29.8,3 30.4,3 v31.4,2
  other vias: 74.4,2
N$73
  Top 0.3: TR2.3 21.65,4.55 22.1,5 22.9,5 24.6,3.3 28.3,3.3 31.2,6.2 31.2,6.8 32.25,7.85 R8.1
N$74  (via drill 0.6)
  Top 0.3: TR2.2 21.7,2.7 22.3,2.1 v23.1,2.1 23.75,2.1 24.05,1.8 R9.2
  Bottom 0.3: IC1.24 19.85,5.7 19.85,5.35 v23.1,2.1
N$75  (via drill 0.6)  (2 unrouted)
  Bottom 0.3: IC1.22 20.85,5.95 23,3.8 23.6,3.8 24.4,3 26,3 26.6,3.6 28.4,3.6 v30,2
  other vias: 73,2
N$95  (via drill 0.6)  (2 unrouted)
  Bottom 0.3: IC1.19 22.35,6.05 23.4,5 24,5 24.8,4.2 25.6,4.2 26.2,4.8 28.8,4.8 30,3.6 30.6,3.6 31.2,3 31.8,3 v32.8,2
  other vias: 75.8,2
N$96  (via drill 0.6)
  Top 0.2: 4.5,26 3.5,26 3.4,26 3,25.6 3,25.4 3,19 3,18.4 2.6,18 1.5,18 | 1.5,12 4.6,12
  Top 0.3: IC3.3 5.6,27.6 5,27 5,26.5 5,26.4 4.6,26 4.5,26 | 1.5,12 1.4,12 0.9,12.5 0.9,17.4 0.9,17.5 1.4,18 1.5,18 | 4.6,12 4.7,12 5.2,11.5 5.2,7.4 5.2,5.8 6.6,4.4 6.6,1.5 7.4,0.7 18.6,0.7 18.7,0.8 21.5,0.8 21.8,1.1 27.7,1.1 v28.6,2
  Bottom 0.3: IC1.23 20.35,5.65 22.8,3.2 23.4,3.2 24.2,2.4 26.2,2.4 26.8,3 27.6,3 v28.6,2
RB0
  Bottom 0.2: 3.5,26 4.5,26
  Bottom 0.3: 4.5,26 4.6,26 5.2,25.4 5.2,25 6.4,23.8 6.4,23.4 7.6,22.2 7.6,21.8 8.8,20.6 8.8,20.2 10,19 10,18.6 11.4,17.2 12.8,17.2 13.25,16.75 IC1.48 | 3.5,26 3,26 CN2.20
RB1
  Bottom 0.3: CN2.19 4.4,25 5.8,23.6 5.8,23.2 7,22 7,21.6 8.2,20.4 8.2,20 9.2,19 9.4,18.8 9.4,18.4 11.2,16.6 12.6,16.6 12.95,16.25 IC1.47
RB2
  Bottom 0.2: 3.5,24 4.5,24
  Bottom 0.3: CN2.18 3,24 3.5,24 | 4.5,24 4.6,24 5.2,23.4 5.2,23 6.4,21.8 6.4,21.4 7.6,20.2 7.6,19.8 8.8,18.6 8.8,18.2 11,16 12.4,16 12.65,15.75 IC1.46
RB3
  Bottom 0.3: CN2.17 4.4,23 5.8,21.6 5.8,21.2 7,20 7,19.6 8.2,18.4 8.2,18 10.8,15.4 12.2,15.4 12.35,15.25 IC1.45
RB4
  Bottom 0.2: 3.5,22 4.5,22
  Bottom 0.3: CN2.16 3,22 3.5,22 | 4.5,22 4.6,22 5.2,21.4 5.2,21 6.4,19.8 6.4,19.4 7.6,18.2 7.6,17.8 10.6,14.8 12,14.8 12.05,14.75 IC1.44
RB5
  Bottom 0.3: CN2.15 4.4,21 5.8,19.6 5.8,19.2 7,18 7,17.6 10.6,14 11.6,14 11.85,14.25 IC1.43
RB6  (via drill 0.6)
  Top 0.3: v10,12.4 10,10.9 11,9.9 11,4.4 9.4,2.8 8.72,2.8 ICSP.5
  Bottom 0.2: 3.5,20 4.5,20
  Bottom 0.3: CN2.14 3,20 3.5,20 | 4.5,20 4.6,20 5.2,19.4 5.2,19 6.4,17.8 6.4,17.4 9.4,14.4 9.4,13 v10,12.4 11,13.4 11.8,13.4 12.15,13.75 IC1.42
RB7  (via drill 0.6)
  Top 0.3: ICSP.4 10.46,3.06 11.6,4.2 11.6,10.6 v11.2,11
  Bottom 0.3: IC1.37 12.05,11.25 11.8,11 v11.2,11 10,11 8.8,12.2 8.8,14.2 5.8,17.2 5.8,17.6 4.4,19 CN2.13
RC0
  Bottom 0.3: IC1.30 16.85,6.05 16,5.2 14.2,5.2 13,6.4 9,6.4 4.4,11 CN2.5
RC1
  Bottom 0.2: 3.5,10 4.5,10
  Bottom 0.3: IC1.29 17.35,5.75 16.2,4.6 14,4.6 12.8,5.8 8.8,5.8 4.6,10 4.5,10 | CN2.6 3,10 3.5,10
RC2
  Bottom 0.3: CN2.9 4.8,15 6.4,13.4 6.4,11.4 9.6,8.2 12.2,8.2 13.25,9.25 IC1.33
RC3
  Bottom 0.2: 3.5,16 4.5,16
  Bottom 0.3: CN2.10 3,16 3.5,16 | IC1.34 12.95,9.75 12,8.8 9.8,8.8 7,11.6 7,13.6 4.6,16 4.5,16
RC4
  Bottom 0.3: IC1.35 12.65,10.25 11.8,9.4 10,9.4 7.6,11.8 7.6,13.8 4.4,17 CN2.11
RC5
  Bottom 0.2: 3.5,18 4.5,18
  Bottom 0.3: CN2.12 3,18 3.5,18 | IC1.36 12.35,10.75 11.6,10 10.2,10 8.2,12 8.2,14 5.2,17 5.2,17.4 4.6,18 4.5,18
RC6
  Bottom 0.3: IC1.31 16.35,6.35 15.8,5.8 14.4,5.8 13.2,7 9.2,7 5.24,10.96 5.24,11.76 CN2.7
RC7
  Bottom 0.2: 3.5,14 4.5,14
  Bottom 0.3: CN2.8 3,14 3.5,14 | IC1.32 15.85,6.65 15.6,6.4 14.6,6.4 13.4,7.6 9.4,7.6 5.8,11.2 5.8,13.2 5,14 4.5,14
RE0
  Bottom 0.2: 3.2,33.8 3.3,33.8 3.5,34 4.5,34
  Bottom 0.3: IC1.2 26.25,16.25 26.8,16.8 26.8,18.4 25.2,20 25.2,26.4 23.8,27.8 23.8,29.8 23.75,29.85 23.75,31.45 21.6,33.6 5,33.6 4.6,34 4.5,34 | CN2.28 2.8,33.8 3.2,33.8
RE1
  Bottom 0.3: IC1.1 25.95,16.75 26.2,17 26.2,18.2 24.6,19.8 24.6,22.4 24.6,26.2 23.2,27.6 23.2,31.2 21.4,33 CN2.27
RE2
  Bottom 0.2: 3.5,32 4.5,32
  Bottom 0.3: CN2.26 2.4,31.4 2.8,31.4 3.4,32 3.5,32 | 4.5,32 4.8,32 5.2,32.4 13.8,32.4 17.8,28.4 21.6,28.4 24,26 24,20 23.35,19.35 IC1.64
RE3
  Bottom 0.3: CN2.25 4.6,31 5.4,31.8 13.6,31.8 17.6,27.8 21.4,27.8 23.4,25.8 23.4,20.2 22.85,19.65 IC1.63
RE4
  Bottom 0.2: 3.5,30 4.5,30
  Bottom 0.3: CN2.24 3,30 3.5,30 | 4.5,30 4.6,30 5.8,31.2 13.4,31.2 17.4,27.2 21.2,27.2 22.8,25.6 22.8,20.4 22.35,19.95 IC1.62
RE5
  Bottom 0.3: CN2.23 4.4,29 6,30.6 13.2,30.6 17.2,26.6 21,26.6 22.2,25.4 22.2,20.6 21.85,20.25 IC1.61
RE6
  Bottom 0.2: 3.5,28 4.5,28
  Bottom 0.3: CN2.22 3,28 3.5,28 | 4.5,28 4.6,28 5.2,28.6 5.2,29 6.2,30 13,30 17,26 20.8,26 21.6,25.2 21.6,20.8 21.35,20.55 IC1.60 21.35,17.75 21.2,17.6 20.6,17.6 20.35,17.85 IC1.58
RE7
  Bottom 0.3: CN2.21 4.4,27.4 4.8,27.4 5.8,28.4 5.8,28.8 6.4,29.4 12.8,29.4 16.8,25.4 20.6,25.4 21,25 21,22.8 | IC1.59 20.85,19.6 20.85,20.85 21,21 21,22.8 | IC1.55 18.85,19.85 19,20 19,21.6 20.2,22.8 21,22.8
VBAT  (via drill 0.6 pad 1)
  Top 0.5: IC10.1 37,18.6 | 37,18.6 37.25,18.85 C2.1 37.25,21.3 36.85,21.7 34.7,21.7 34.5,21.5 IC9.2 | 37,18.6 v38.3,17.3 PTC3.1
  Bottom 0.5: D1.C TR3.2 38.05,17.55 v38.3,17.3
VDD  (via drill 0.6)  (2 unrouted)
  Top 0.3: IC3.11 5.6,18 5.2,17.6 5.2,14.2 6.4,13 6.4,12.2 6.65,11.95 | ICSP.2 16.57,3.03 16.83,3.03 v17.6,3.8 | v17.6,3.8 15.7,5.7 15.7,8.1 v11.4,12.4 | v28.6,12 28,11.4 28,8 v27.6,7.6 27.4,7.4 25.8,7.4 25.4,7 20.2,7 20,6.8 18.3,5.1 18.3,4.5 v17.6,3.8 | v33,11.2 33.29,11.49 34.59,11.49 35.95,12.85 C8.1 35.95,15.25 IC10.5 | v6.7,6.5 6.7,7.3 6.4,7.6 6.4,11.7 6.65,11.95 | C11.1 6.65,11.95
  Bottom 0.3: v11.4,12.4 11.85,11.95 C1.2 12.8,11.75 IC1.38 | IC1.10 27.25,12.25 27.55,12.55 C4.2 28.4,13 28.6,12.8 v28.6,12 | CN2.3 4.8,9 5.8,8 5.8,7.4 v6.7,6.5 7.3,6.5 8.4,5.4 8.4,4.4 8.9,3.9 9.7,3.9 10.4,4.6 12.4,4.6 12.7,4.3 13.6,3.4 17.2,3.4 v17.6,3.8 | v27.6,7.6 30.8,7.6 33,9.8 v33,11.2
  other vias: 71.6,12

### Text on the board
tPlace: CHG&CONFIG | @IMD555 | 3:VDD | 1:Vbat | H / 0 | A / 2 | G / 67
bPlace: 34 | 12 | 0 / 2 / E / 4 / 6 | 1 / 3 / E / 5 / 7 | ↓Pairing | LiPo | 0 / 2 / B / 4 / 6 | 1 / 3 / B / 5 / 7 | @IMD555 | Connect to UI board. | 5 / 3 / C / 7 / 1 | 4 / 2 / C / 6 / 0 | H / 0 | A / 2 | G / 76
tValues: 0 / 2 / E / 4 / 6 | 0 / 2 / B / 4 / 6 | 5 / 3 / C / 7 / 1
bValues: 3:VDD | 1:Vbat
_tNames: CN1 | PTC2 | IC3 | C10 | IC8 | R4 | R5 | C12 | R11 | IC9 | C2 | SJ1 | TR1 | IC10 | R7 | R10 | CN2 | C8 | C11 | R8 | PTC3 | R12 | R13 | TR2 | PTC4 | R9
_bNames: CN4 | LED1 | SW1 | C3 | C5 | CN5 | SW2 | R2 | R3 | R1 | R6 | C6 | C7 | D1 | IC1 | IC2 | TR3 | C1 | C4 | SW3 | ICSP